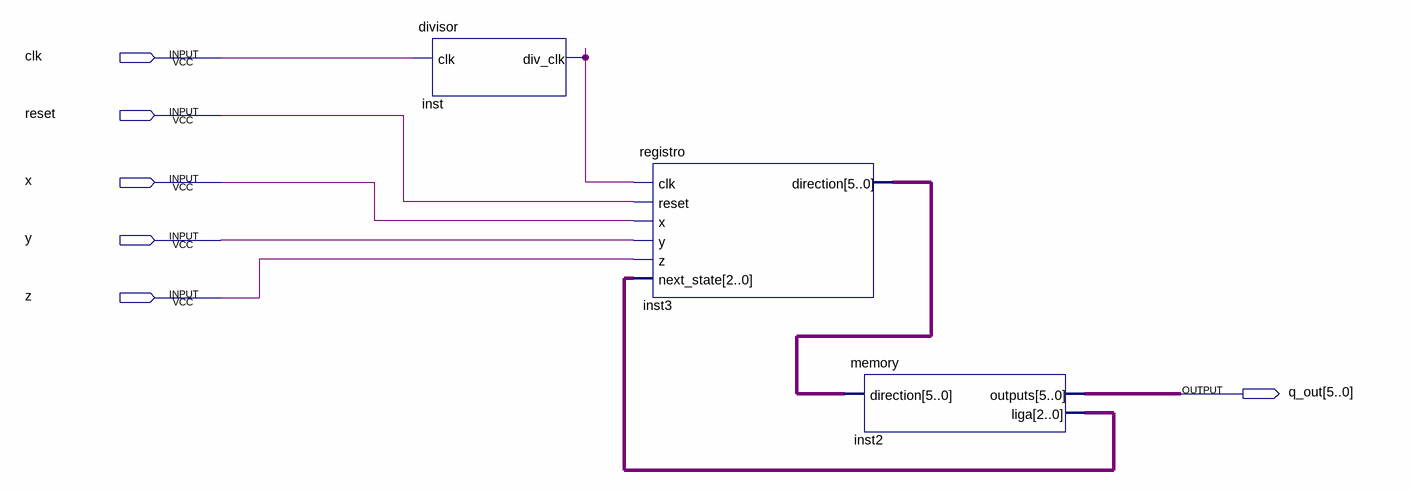
[diagram p0: schematic sheet]
// Quartus schematic main.bdf as structural Verilog: 3 symbols, 6 pins
module main (
  input  clk,
  input  reset,
  input  x,
  input  y,
  input  z,
  output [5:0] q_out
);

  wire inst_div_clk;
  wire [2:0] inst2_liga;
  wire [5:0] inst3_direction;

  divisor inst (.clk(clk), .div_clk(inst_div_clk));
  registro inst3 (
    .clk(inst_div_clk), .reset(reset), .x(x), .y(y), .z(z), .next_state(inst2_liga),
    .direction(inst3_direction));
  memory inst2 (.direction(inst3_direction), .outputs(q_out), .liga(inst2_liga));
endmodule
